# Altium schematic sheet MCU.SchDoc: MCU(EFM32PG12) circuit
size A4; Revision: 1-1; SheetNumber: 3; SheetTotal: 6
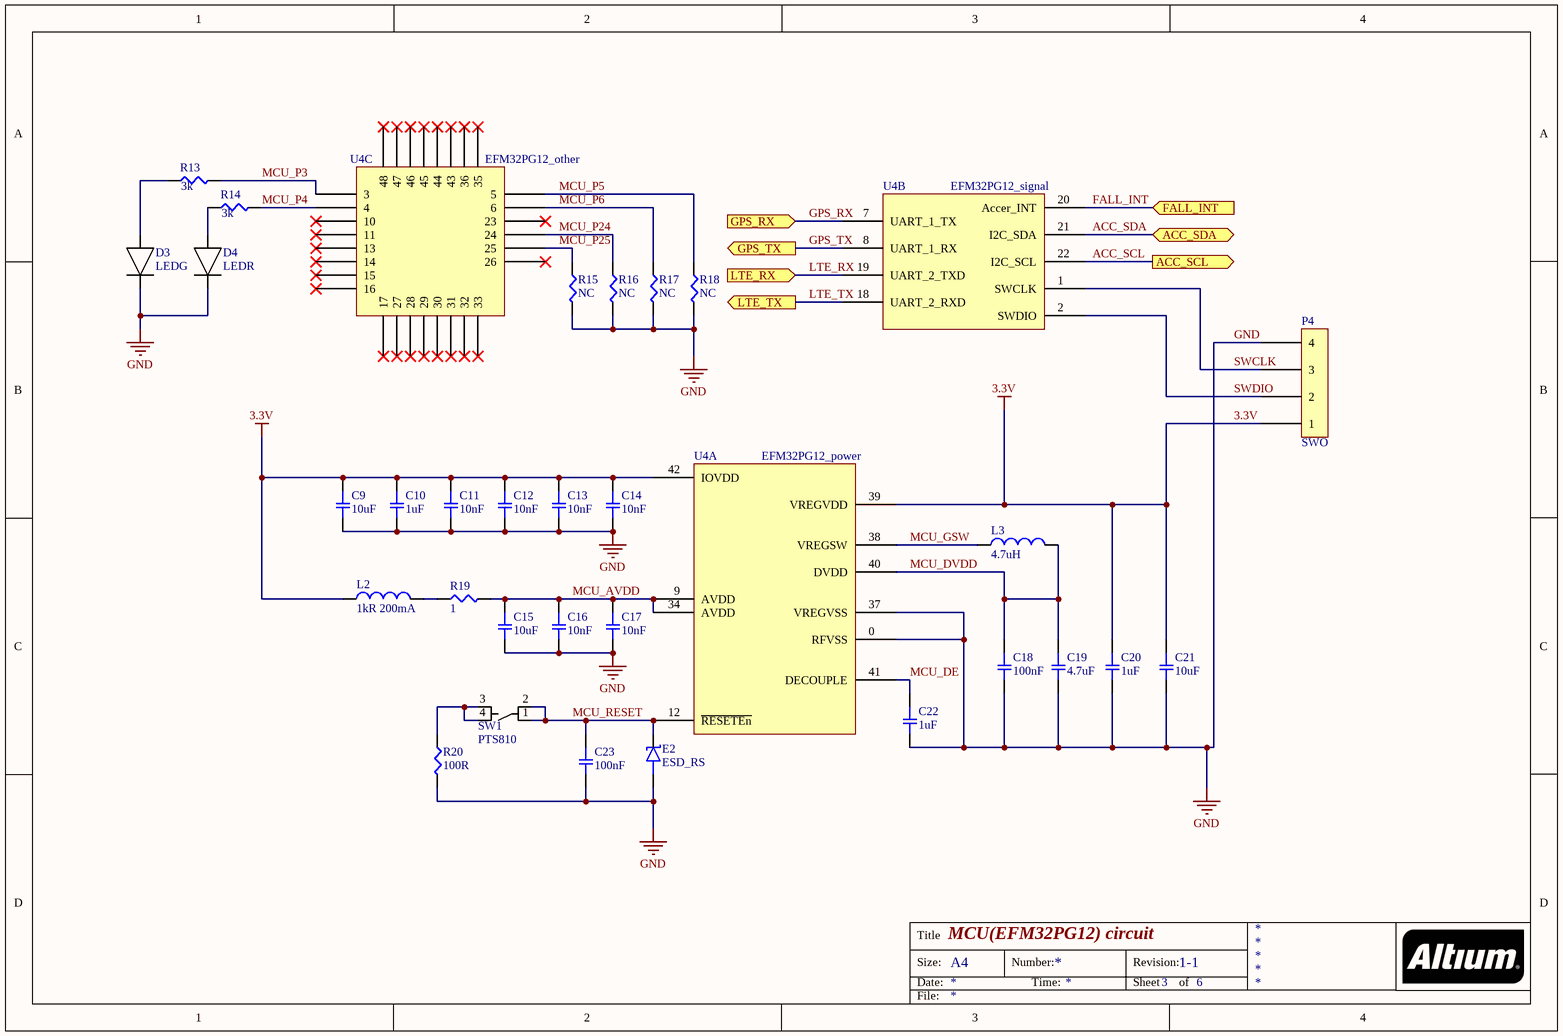
[diagram p0: MCU.SchDoc]

## Parts
C9  value 10uF  [0603-CAP]  (hidden comment: 0603C 10UF)
C10  value 1uF  [0603-CAP]  (hidden comment: 0603C 1UF)
C11  value 10nF  [0603-CAP]  (hidden comment: 0603C 10NF)
C12  value 10nF  [0603-CAP]  (hidden comment: 0603C 10NF)
C13  value 10nF  [0603-CAP]  (hidden comment: 0603C 10NF)
C14  value 10nF  [0603-CAP]  (hidden comment: 0603C 10NF)
C15  value 10uF  [0603-CAP]  (hidden comment: 0603C 10UF)
C16  value 10nF  [0603-CAP]  (hidden comment: 0603C 10NF)
C17  value 10nF  [0603-CAP]  (hidden comment: 0603C 10NF)
C18  value 100nF  [0603-CAP]  (hidden comment: 0603C 100NF)
C19  value 4.7uF  [0603-CAP]  (hidden comment: 0603C 4U7F)
C20  value 1uF  [0603-CAP]  (hidden comment: 0603C 1UF)
C21  value 10uF  [0603-CAP]  (hidden comment: 0603C 10UF)
C22  value 1uF  [0603-CAP]  (hidden comment: 0603C 1UF)
C23  value 100nF  [0603-CAP]  (hidden comment: 0603C 100NF)
D3  LEDG  [0603-LED]
D4  LEDR  [0603-LED]
E2  ESD_RS  [ESD_RS]
L2  value 1kR 200mA  [0603-FerritBead]  (hidden comment: Ferrite Bead)
L3  value 4.7uH  [Inductor 4U7H]  (hidden comment: Inductor 4U7H)
P4  SWO  [4_PINS_2.54]
R13  value 3k  [0603-RES]  (hidden comment: 3KR)
R14  value 3k  [0603-RES]  (hidden comment: 3KR)
R15  value NC  [0603-RES]  (hidden comment: 0603R NC)
R16  value NC  [0603-RES]  (hidden comment: 0603R NC)
R17  value NC  [0603-RES]  (hidden comment: 0603R NC)
R18  value NC  [0603-RES]  (hidden comment: 0603R NC)
R19  value 1  [0603-RES]  (hidden comment: 0603R 1R)
R20  value 100R  [0603-RES]  (hidden comment: 0603R 100R)
SW1  PTS810  [*SW_PTS810_SJM_250_SMTR_LFS]
U4  EFM32PG12_power  [QFN50P700X700X90_HS-49N_]  (parts A,B,C of 3)

## Ports
ACC_SCL (out), ACC_SDA (bidir), FALL_INT (in), GPS_RX (in), GPS_TX (out), LTE_RX (in), LTE_TX (out)

## Nets
3.3V: C9.1 C10.1 C11.1 C12.1 C13.1 C14.1 C20.1 C21.1 L2.1 P4.1 U4.39(VREGVDD) U4.42(IOVDD)
GND: C9.2 C10.2 C11.2 C12.2 C13.2 C14.2 C15.2 C16.2 C17.2 C18.2 C19.2 C20.2 C21.2 C22.2 C23.2 D3.2 D4.2 E2.2 P4.4 R15.2 R16.2 R17.2 R18.2 R20.2 U4.0(RFVSS) U4.37(VREGVSS)
ACC_SCL: U4.22(I2C_SCL) ; port ACC_SCL
ACC_SDA: U4.21(I2C_SDA) ; port ACC_SDA
FALL_INT: U4.20(Accer_INT) ; port FALL_INT
GPS_RX: U4.7(UART_1_TX) ; port GPS_RX
GPS_TX: U4.8(UART_1_RX) ; port GPS_TX
LTE_RX: U4.19(UART_2_TXD) ; port LTE_RX
LTE_TX: U4.18(UART_2_RXD) ; port LTE_TX
MCU_AVDD: C15.1 C16.1 C17.1 R19.2 U4.9(AVDD) U4.34(AVDD)
MCU_DE: C22.1 U4.41(DECOUPLE)
MCU_DVDD: C18.1 C19.1 L3.2 U4.40(DVDD)
MCU_GSW: L3.1 U4.38(VREGSW)
MCU_P3: R13.2 U4.3
MCU_P4: R14.2 U4.4
MCU_P5: R18.1 U4.5
MCU_P6: R17.1 U4.6
MCU_P24: R16.1 U4.24
MCU_P25: R15.1 U4.25
MCU_RESET: C23.1 E2.1 SW1.1 SW1.2 U4.12(~{RESETEn})
SWCLK: P4.3 U4.1(SWCLK)
SWDIO: P4.2 U4.2(SWDIO)
NetD3_1: D3.1 R13.1
NetD4_1: D4.1 R14.1
NetL2_2: L2.2 R19.1
NetR20_1: R20.1 SW1.3 SW1.4

Not connected (* = marked no-connect by the designer): U4 10* 11* 13* 14* 15* 16* 17* 23* 26* 27* 28* 29* 30* 31* 32* 33* 35* 36* 43* 44* 45* 46* 47* 48*

## Notes on the sheet
- Title
- Size:
- Date:
- A4
- Number:
- Time:
- Revision:
- Sheet
- of
- File:

## Library data of the parts
D3 = 0603 LEDG: Supplier 1: Digi-Key; Supplier Part Number 1: 160-1183-6-ND; Value: LEDG
D4 = 0603 LEDR: Supplier 1: Digi-Key; Supplier Part Number 1: 160-1181-6-ND; Value: LEDR
E2 = ESD_RESET: Supplier 1: Digi-Key; Supplier Part Number 1: F7701CT-ND
P4 = 4pins_connector
R13 R14 = 0603R 3KR: Supplier 1: Digi-Key; Supplier Part Number 1: 311-3.00KHRCT-ND
SW1 = PTS810_SJM_250_SMTR_LFS: Tactile Switch SPST-NO Top Actuated Surface Mount; MP: PTS810 SJM 250 SMTR LFS; MF: C&K; Availability: Unavailable; Package: None; Price: 0.3; SnapEDA_Link: https://www.snapeda.com/parts/PTS810%20SJM%20250%20SMTR%20LFS/C%26K/view-part/522770/?ref=snap; Value: *; Digikey link: https://www.digikey.com/product-detail/en/c-k/PTS810-SJM-250-SMTR-LFS/CKN10502CT-ND/4176673; Digikey part number: CKN10502CT-ND
U4 = EFM32PG12: MP: EFM32PG12B500F1024GM48-C; MF: Silicon Labs; Digikey link: https://www.digikey.com/product-detail/en/silicon-labs/EFM32PG12B500F1024GM48-C/336-4419-ND/8186199; Digikey part number: 336-4419-ND; Datasheet link: https://www.silabs.com/documents/public/data-sheets/efm32pg12-datasheet.pdf; Package: 48-VFQFN Exposed Pad; Price: 4.43; Supplier 1: Digi-Key; Supplier Part Number 1: 336-4419-ND
C9 C15 C21 = 0603C 10UF: Supplier 1: Digi-Key; Supplier Part Number 1: 490-10474-1-ND
C10 C20 C22 = 0603C 1UF: Supplier 1: Digi-Key; Supplier Part Number 1: 490-6408-1-ND
C11-C14 C16 C17 = 0603C 10NF: Supplier 1: Digi-Key; Supplier Part Number 1: 490-8028-1-ND
C18 C23 = 0603C 100NF: Supplier 1: Digi-Key; Supplier Part Number 1: 490-8020-1-ND
C19 = 0603C 4U7F: Supplier 1: Digi-Key; Supplier Part Number 1: 399-3482-1-ND
L2 = Ferrite Bead: Supplier 1: Digi-Key; Supplier Part Number 1: 732-4484-1-ND
L3 = Inductor 4U7H: Supplier 1: Digi-Key; Supplier Part Number 1: 490-15954-1-ND
R15-R18 = 0603R NC: Package: 0603
R19 = 0603R 1R: Package: 0603; Supplier 1: Digi-Key; Supplier Part Number 1: 311-1.00HRCT-ND
R20 = 0603R 100R: Package: 0603; Supplier 1: Digi-Key; Supplier Part Number 1: 311-100HRCT-ND